# Altium project New_MB.PrjPcb
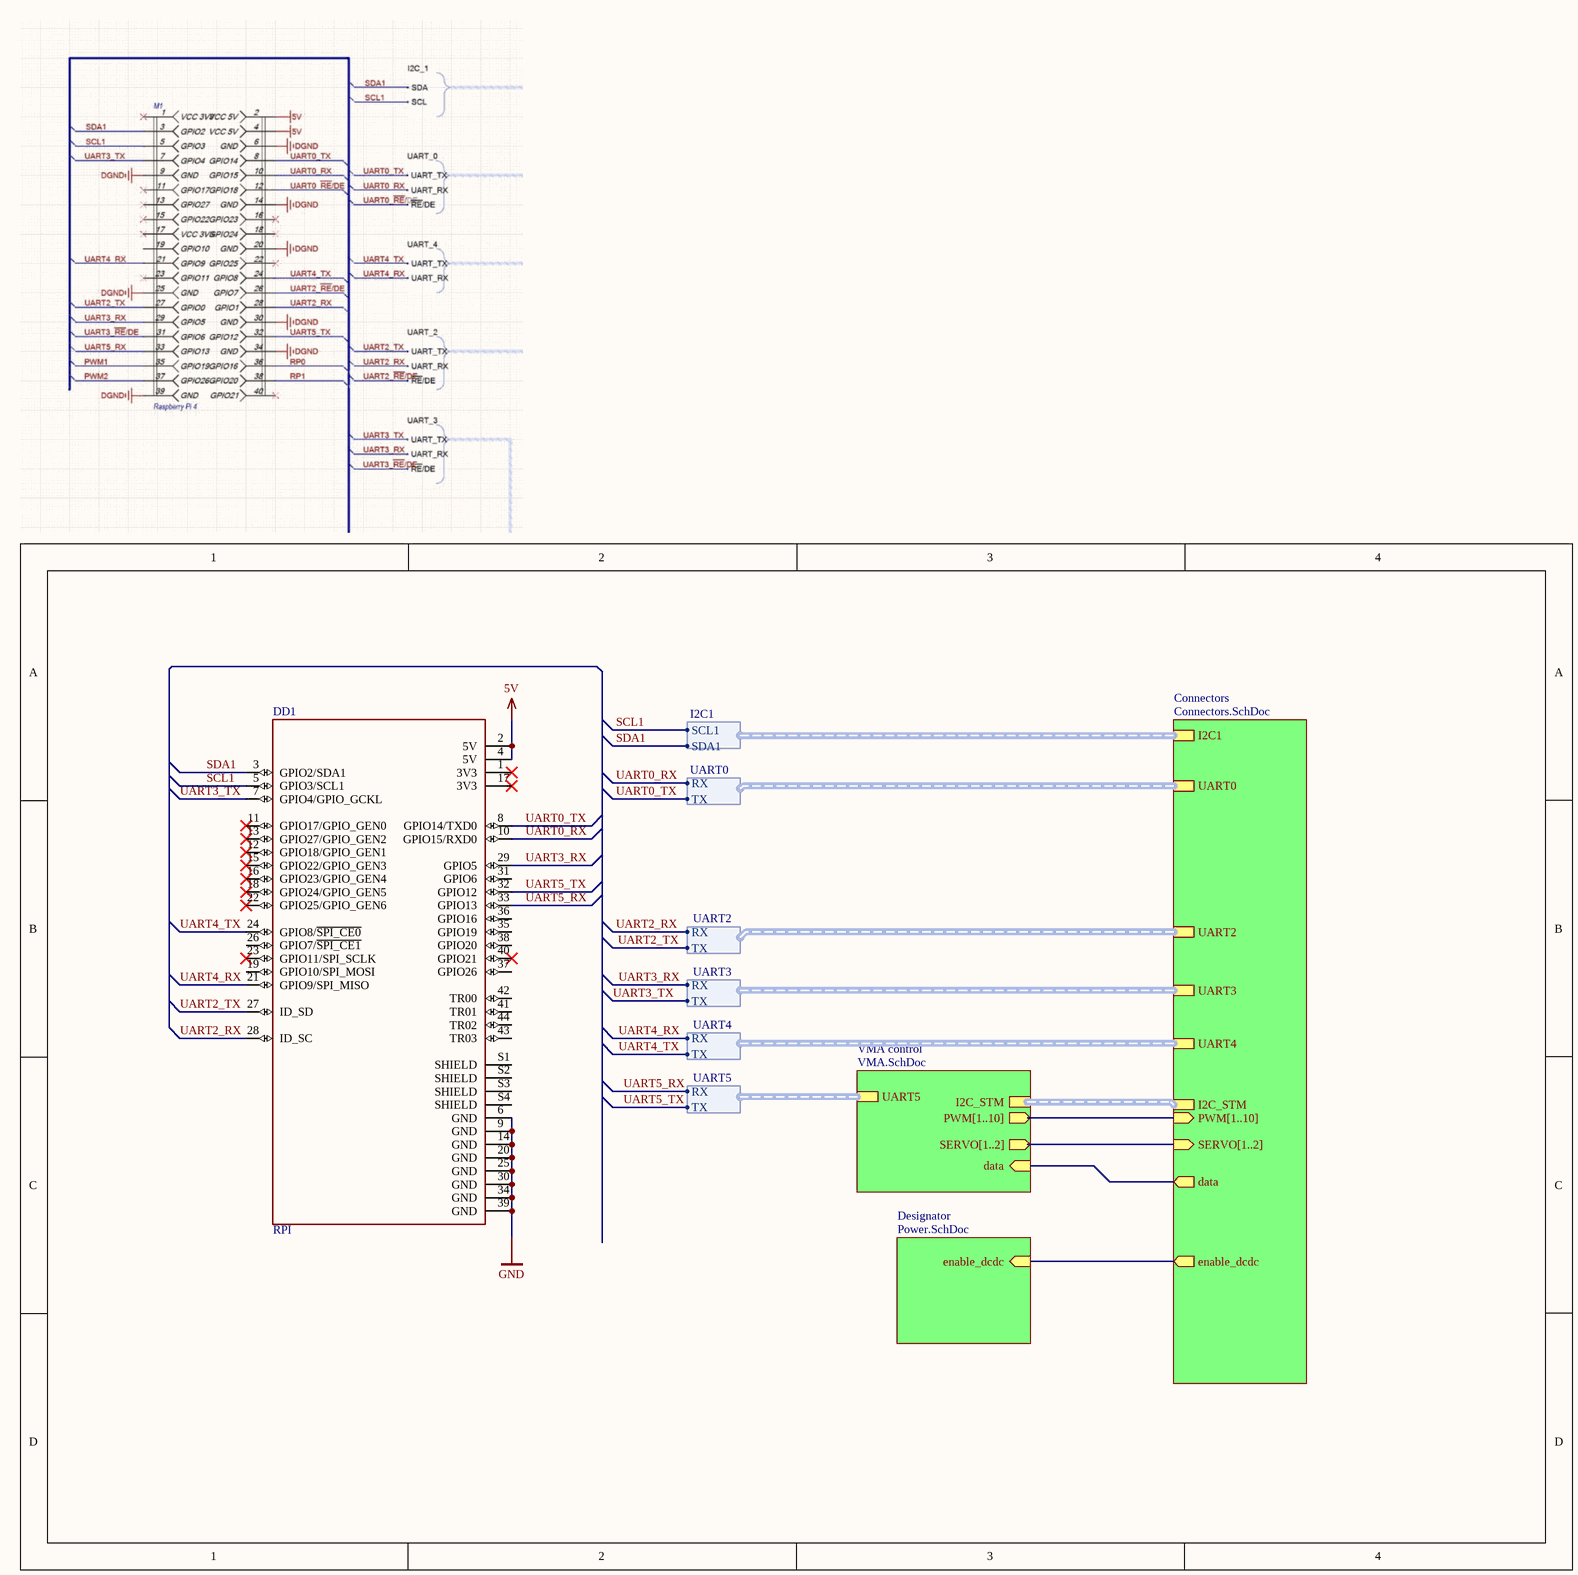
[diagram p0: Main.SchDoc]
4 sheets, 25 parts. Net scope: hierarchical (ports join the sheet entries above them; power ports are global).
Board file: Motherboard_Neowelt.PcbDoc
Sheets:
  Main.SchDoc
    VMA control = VMA.SchDoc
    Connectors = Connectors.SchDoc
    Designator = Power.SchDoc

## Sheet Main.SchDoc
size A4; SheetNumber: 1; SheetTotal: 4

### Parts
DD1  RPI  [RPI]

### Sub-sheets
Connectors = Connectors.SchDoc: PWM[1..10] (in), SERVO[1..2] (in), I2C1 (harness I2C1), UART3 (harness UART3), UART0 (harness UART0), UART2 (harness UART2), I2C_STM (harness I2C_STM), UART4 (harness UART4), enable_dcdc (out), data (out)
Designator = Power.SchDoc: enable_dcdc (in)
VMA control = VMA.SchDoc: UART5 (harness UART5), I2C_STM (harness I2C_STM), PWM[1..10] (out), SERVO[1..2] (out), data (in)

### Harnesses
I2C1: SCL1, SDA1
UART0: RX, TX
UART2: RX, TX
UART3: RX, TX
UART4: RX, TX
UART5: RX, TX

### Nets
5V: DD1.2(5V) DD1.4(5V)
GND: DD1.6(GND) DD1.9(GND) DD1.14(GND) DD1.20(GND) DD1.25(GND) DD1.30(GND) DD1.34(GND) DD1.39(GND)
data: sheet VMA control/data, sheet Connectors/data
enable_dcdc: sheet Connectors/enable_dcdc, sheet Designator/enable_dcdc
SCL1: DD1.5(GPIO3/SCL1) ; sheet Connectors/I2C1.SCL1  [project net I2C1_SCL]
SDA1: DD1.3(GPIO2/SDA1) ; sheet Connectors/I2C1.SDA1  [project net I2C1_SDA]
UART0_RX: DD1.10(GPIO15/RXD0) ; sheet Connectors/UART0.RX
UART0_TX: DD1.8(GPIO14/TXD0) ; sheet Connectors/UART0.TX
UART2_RX: DD1.28(ID_SC) ; sheet Connectors/UART2.RX
UART2_TX: DD1.27(ID_SD) ; sheet Connectors/UART2.TX
UART3_RX: DD1.29(GPIO5) ; sheet Connectors/UART3.RX
UART3_TX: DD1.7(GPIO4/GPIO_GCKL) ; sheet Connectors/UART3.TX
UART4_RX: DD1.21(GPIO9/SPI_MISO) ; sheet Connectors/UART4.RX
UART4_TX: DD1.24(GPIO8/~{SPI_CE0}) ; sheet Connectors/UART4.TX
UART5_RX: DD1.33(GPIO13) ; sheet VMA control/UART5.RX  [project net STM_TX]
UART5_TX: DD1.32(GPIO12) ; sheet VMA control/UART5.TX  [project net STM_RX]

Not connected (* = marked no-connect by the designer): DD1 1(3V3)* 11(GPIO17/GPIO_GEN0)* 12(GPIO18/GPIO_GEN1)* 13(GPIO27/GPIO_GEN2)* 15(GPIO22/GPIO_GEN3)* 16(GPIO23/GPIO_GEN4)* 17(3V3)* 18(GPIO24/GPIO_GEN5)* 19(GPIO10/SPI_MOSI) 22(GPIO25/GPIO_GEN6)* 23(GPIO11/SPI_SCLK)* 26(GPIO7/~{SPI_CE1}) 31(GPIO6) 35(GPIO19) 36(GPIO16) 37(GPIO26) 38(GPIO20) 40(GPIO21)* 41(TR01) 42(TR00) 43(TR03) 44(TR02) S1(SHIELD) S2(SHIELD) S3(SHIELD) S4(SHIELD)

### Buses and harness runs
bus sheet Connectors/PWM[1..10] = sheet VMA control/PWM[1..10]
bus sheet Connectors/SERVO[1..2] = sheet VMA control/SERVO[1..2]
harness sheet Connectors/I2C_STM = sheet VMA control/I2C_STM

### Library data of the parts
DD1 = RPI: Part Number: RPI

## Sheet VMA.SchDoc
size A3; SheetNumber: 4; SheetTotal: 4
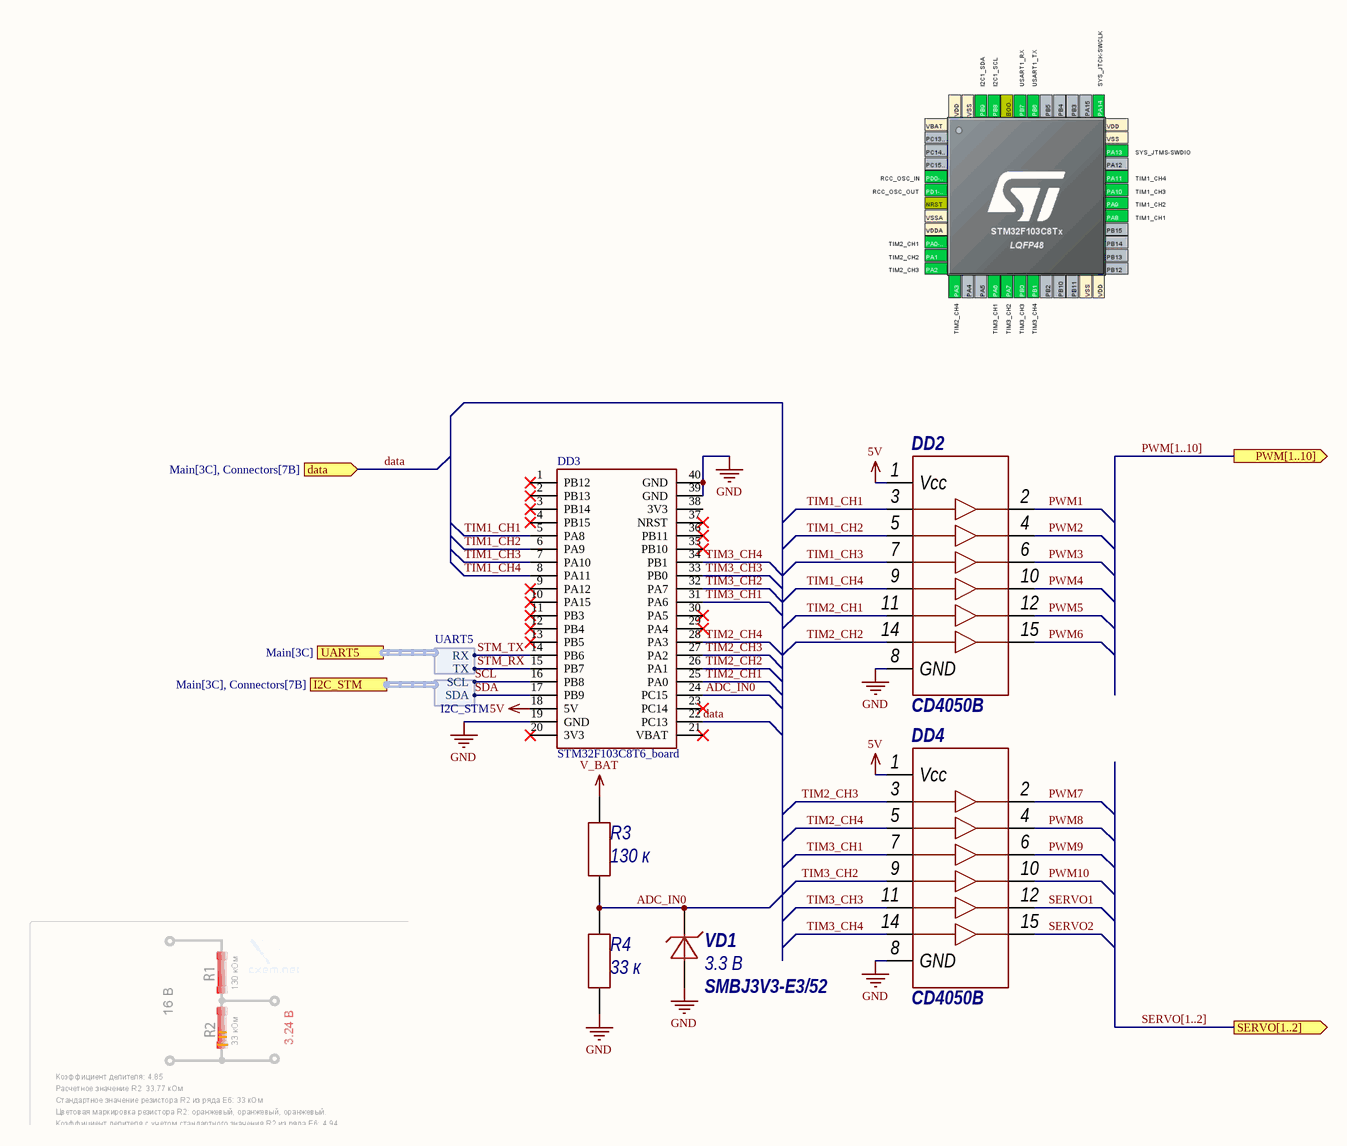
[diagram p1: VMA.SchDoc]

### Parts
DD2  CD4050B  [DIP16_in_socket]
DD3  STM32F103C8T6_board  [STM32F103C8T6_board]
DD4  CD4050B  [DIP16_in_socket]
R3  value 130 к  [0603R]  (hidden comment: Resistor)
R4  value 33 к  [0603R]  (hidden comment: Resistor)
VD1  SMBJ3V3-E3/52  value 3.3 В  [SMB]

### Ports
data (in, see Main[3C], Connectors[7B]), I2C_STM (harness I2C_STM, see Main[3C], Connectors[7B]), PWM[1..10] (out, see Main[3C], Connectors[7C]), SERVO[1..2] (out, see Main[3C], Connectors[7C]), UART5 (harness UART5, see Main[3C])

### Harnesses
UART5: TX, RX
I2C_STM: SCL, SDA

### Nets
5V: DD2.1(Vcc) DD3.18(5V) DD4.1(Vcc)
GND: DD2.8(GND) DD3.19(GND) DD3.39(GND) DD3.40(GND) DD4.8(GND) R4.1 VD1.1
V_BAT: R3.2
ADC_IN0: DD3.24(PC15) R3.1 R4.2 VD1.2
data: DD3.22(PC13) ; port data
PWM1: DD2.2(Y1)
PWM2: DD2.4(Y2)
PWM3: DD2.6(Y3)
PWM4: DD2.10(Y10)
PWM5: DD2.12(Y5)
PWM6: DD2.15(Y6)
PWM7: DD4.2(Y1)
PWM8: DD4.4(Y2)
PWM9: DD4.6(Y3)
PWM10: DD4.10(Y10)
SCL: DD3.16(PB8) ; port I2C_STM.SCL  [project net I2C2_SCL]
SDA: DD3.17(PB9) ; port I2C_STM.SDA  [project net I2C2_SDA]
SERVO1: DD4.12(Y5)
SERVO2: DD4.15(Y6)
STM_RX: DD3.15(PB7) ; port UART5.TX
STM_TX: DD3.14(PB6) ; port UART5.RX
TIM1_CH1: DD2.3(A1) DD3.5(PA8)
TIM1_CH2: DD2.5(A2) DD3.6(PA9)
TIM1_CH3: DD2.7(A3) DD3.7(PA10)
TIM1_CH4: DD2.9(A4) DD3.8(PA11)
TIM2_CH1: DD2.11(A5) DD3.25(PA0)
TIM2_CH2: DD2.14(A6) DD3.26(PA1)
TIM2_CH3: DD3.27(PA2) DD4.3(A1)
TIM2_CH4: DD3.28(PA3) DD4.5(A2)
TIM3_CH1: DD3.31(PA6) DD4.7(A3)
TIM3_CH2: DD3.32(PA7) DD4.9(A4)
TIM3_CH3: DD3.33(PB0) DD4.11(A5)
TIM3_CH4: DD3.34(PB1) DD4.14(A6)

Not connected (* = marked no-connect by the designer): DD3 1(PB12)* 2(PB13)* 3(PB14)* 4(PB15)* 9(PA12)* 10(PA15)* 11(PB3)* 12(PB4)* 13(PB5)* 20(3V3)* 21(VBAT)* 23(PC14)* 29(PA4)* 30(PA5)* 35(PB10)* 36(PB11)* 37(NRST)* 38(3V3)

### Buses and harness runs
bus PWM[1..10] = port PWM[1..10]
bus SERVO[1..2] = port SERVO[1..2]

### Library data of the parts
DD2 DD4 = CD4050B: Шесть буферных элементов; Part Number: CD4050B
DD3 = STM32F103C8T6_board: blue pill; Part Number: STM32F103C8T6_board
R3 = Resistor_130k_1_0603: Резистор номиналом 130 кОм и точностью 1%; Power: *; Part Number: Resistor_130k_1_0603; Tolerance: 1%
R4 = Resistor_33k_1_0603: Резистор номиналом 33 кОм и точностью 1%; Power: *; Part Number: Resistor_33k_1_0603; Tolerance: 1%
VD1 = SMBJ15A: Защитный диод на 15 В, рассеиваемая мощность 600 Вт; Voltage nominal (V): 15; Power (W): 600; Part Number: SMBJ15A; ComponentLink1Description: Где купить; ComponentLink1URL: https://www.chipdip.ru/product/smbj3v3-e3-52-2

## Sheet Connectors.SchDoc
size A3; SheetNumber: 3; SheetTotal: 4
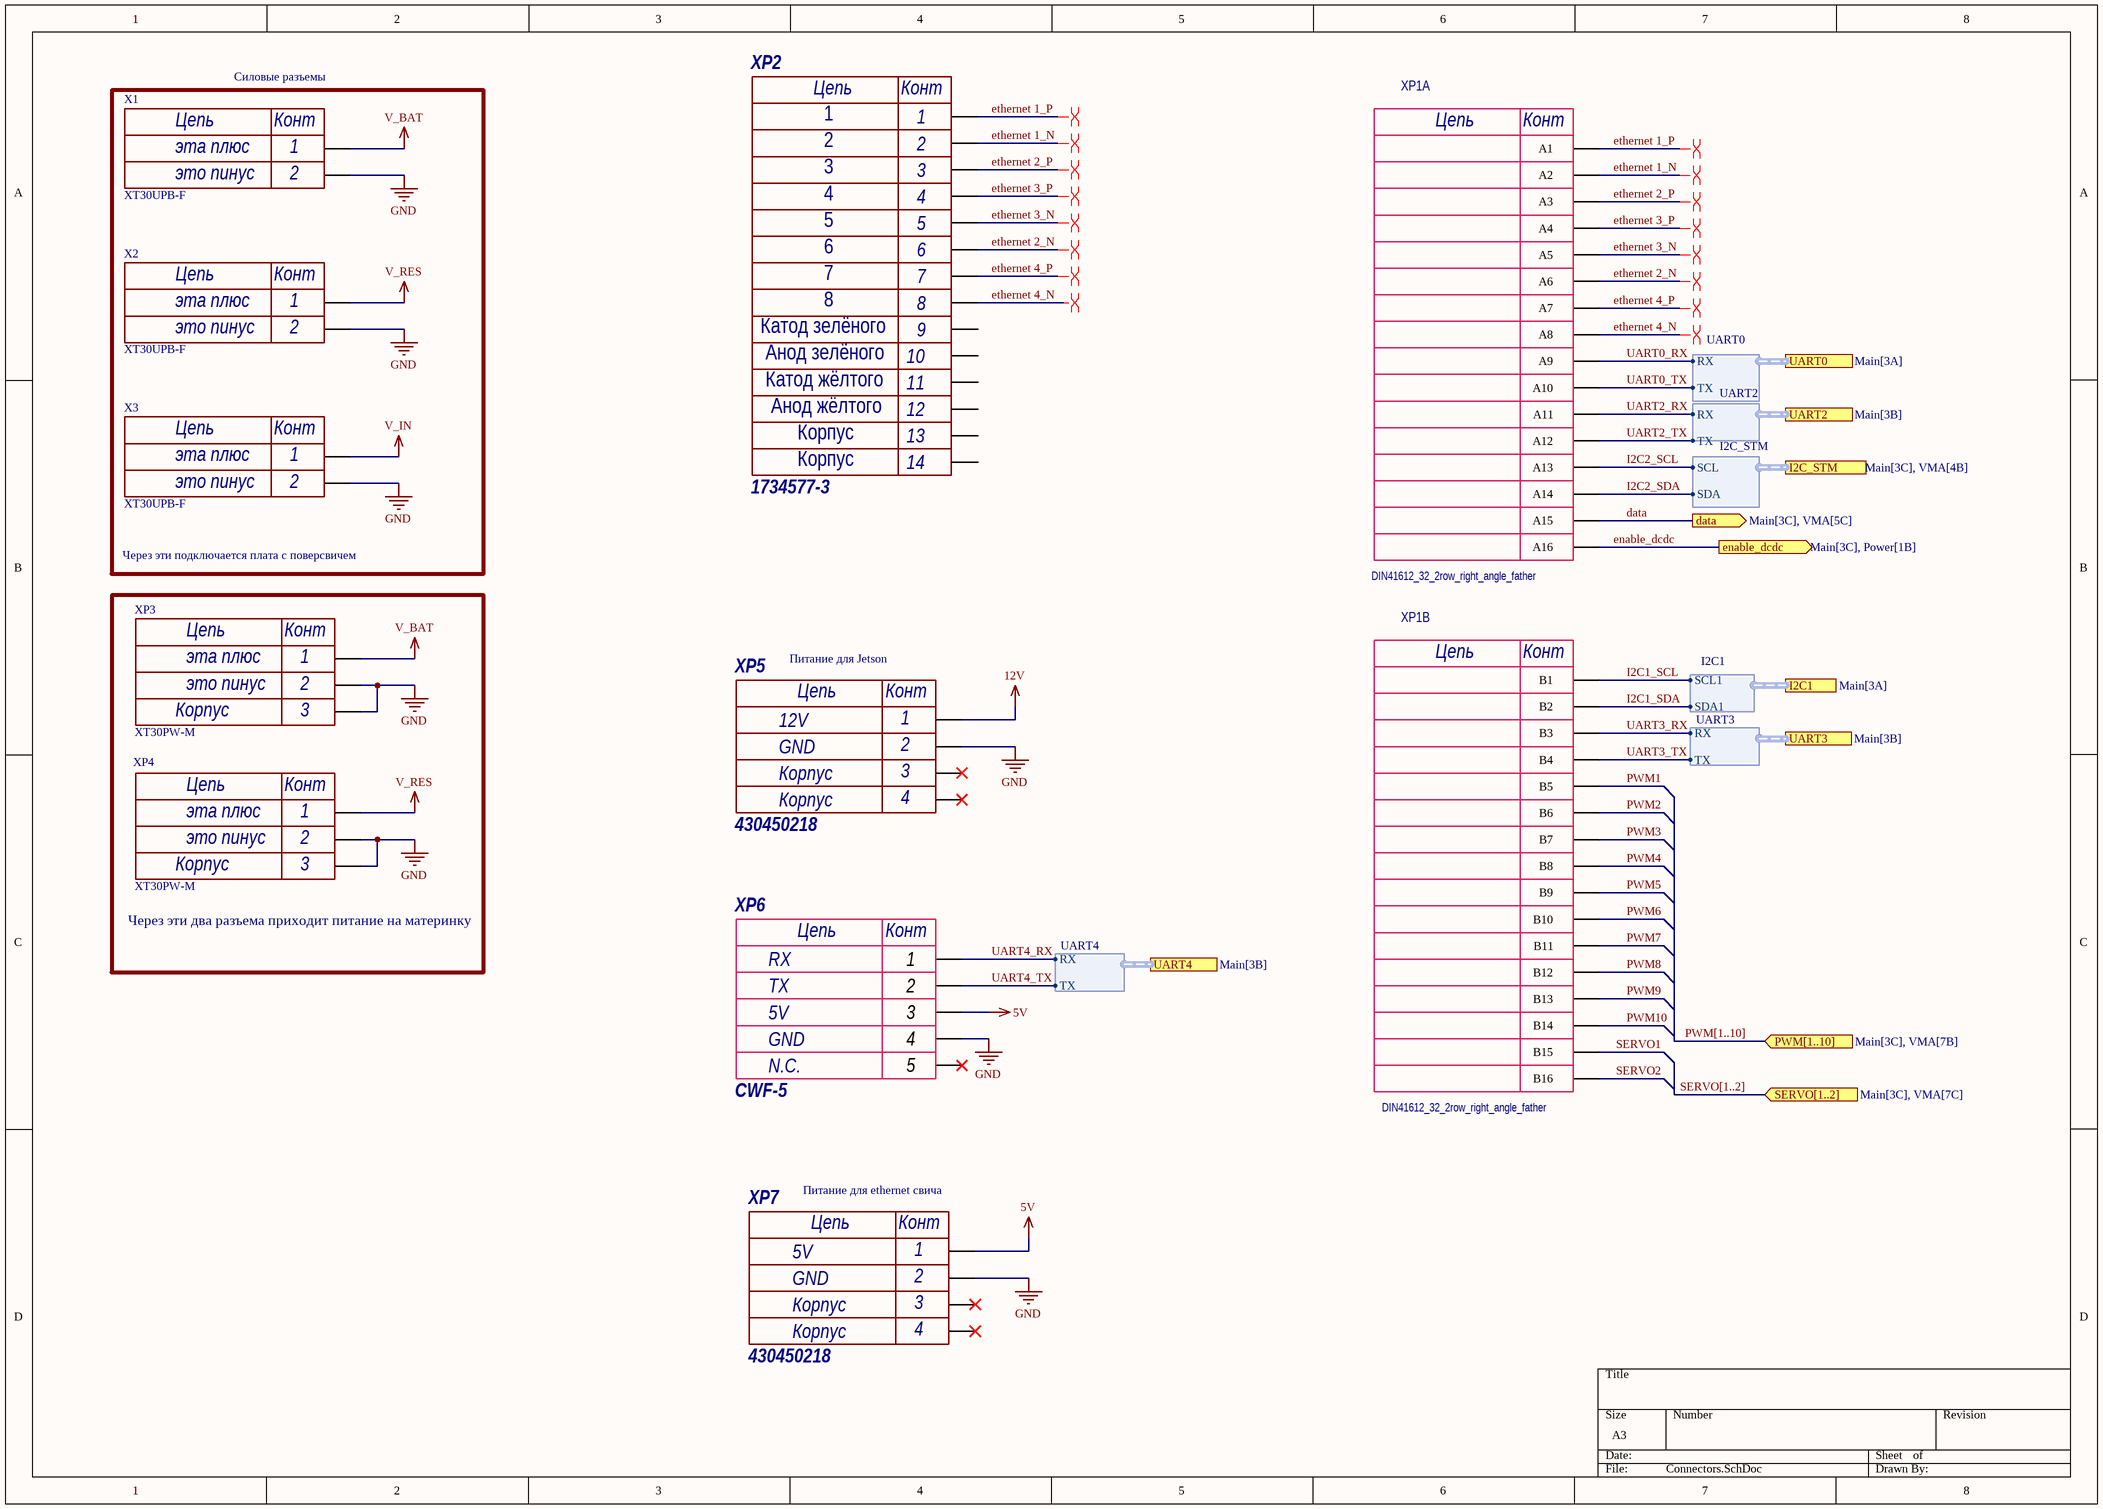
[diagram p2: Connectors.SchDoc]

### Parts
X1  XT30UPB-F  Value2: это пинус  Value1: эта плюс  [XT30UPB-F]
X2  XT30UPB-F  Value2: это пинус  Value1: эта плюс  [XT30UPB-F]
X3  XT30UPB-F  Value2: это пинус  Value1: эта плюс  [XT30UPB-F]
XP1  DIN41612_32_2row_right_angle_father  [DIN41612_32_2row_right_angle_father]  (parts A,B of 2)
XP2  1734577-3  [1-1734577-3-rj45-8p8c]
XP3  XT30PW-M  Value3: Корпус  Value2: это пинус  Value1: эта плюс  [XT30PW-M]
XP4  XT30PW-M  Value3: Корпус  Value2: это пинус  Value1: эта плюс  [XT30PW-M]
XP5  430450218  Value3: Корпус  Value2: GND  Value1: 12V  Parameter 1: Питание для Jetson  [Molex_430450218]
XP6  CWF-5  Value1: RX  Value2: TX  Value3: 5V  Value4: GND  Value5: N.C.  [CWF-5]
XP7  430450218  Value3: Корпус  Value2: GND  Value1: 5V  Parameter 1: Питание для ethernet свича  [Molex_430450218]

### Blocks framed on the sheet
Через эти два разъема приходит питание на материнку: XP3 XP4

### Ports
data (out, see Main[3C], VMA[5C]), enable_dcdc (out, see Main[3C], Power[1B]), I2C1 (harness I2C1, see Main[3A]), I2C_STM (harness I2C_STM, see Main[3C], VMA[4B]), PWM[1..10] (in, see Main[3C], VMA[7B]), SERVO[1..2] (in, see Main[3C], VMA[7C]), UART0 (harness UART0, see Main[3A]), UART2 (harness UART2, see Main[3B]), UART3 (harness UART3, see Main[3B]), UART4 (harness UART4, see Main[3B])

### Harnesses
I2C1: SDA1, SCL1
UART3: RX, TX
UART0: RX, TX
UART2: RX, TX
I2C_STM: SDA, SCL
UART4: RX, TX

### Nets
5V: XP6.3 XP7.1
12V: XP5.1
GND: X1.N X2.N X3.N XP3.0 XP3.N XP4.0 XP4.N XP5.2 XP6.4 XP7.2
V_BAT: X1.P XP3.P
V_IN: X3.P
V_RES: X2.P XP4.P
data: XP1.A15 ; port data
enable_dcdc: XP1.A16 ; port enable_dcdc
ethernet 1_N: XP1.A2 XP2.2
ethernet 1_P: XP1.A1 XP2.1
ethernet 2_N: XP1.A6 XP2.6
ethernet 2_P: XP1.A3 XP2.3
ethernet 3_N: XP1.A5 XP2.5
ethernet 3_P: XP1.A4 XP2.4
ethernet 4_N: XP1.A8 XP2.8
ethernet 4_P: XP1.A7 XP2.7
I2C1_SCL: XP1.B1 ; port I2C1.SCL1
I2C1_SDA: XP1.B2 ; port I2C1.SDA1
I2C2_SCL: XP1.A13 ; port I2C_STM.SCL
I2C2_SDA: XP1.A14 ; port I2C_STM.SDA
PWM1: XP1.B5
PWM2: XP1.B6
PWM3: XP1.B7
PWM4: XP1.B8
PWM5: XP1.B9
PWM6: XP1.B10
PWM7: XP1.B11
PWM8: XP1.B12
PWM9: XP1.B13
PWM10: XP1.B14
SERVO1: XP1.B15
SERVO2: XP1.B16
UART0_RX: XP1.A9 ; port UART0.RX
UART0_TX: XP1.A10 ; port UART0.TX
UART2_RX: XP1.A11 ; port UART2.RX
UART2_TX: XP1.A12 ; port UART2.TX
UART3_RX: XP1.B3 ; port UART3.RX
UART3_TX: XP1.B4 ; port UART3.TX
UART4_RX: XP6.1 ; port UART4.RX
UART4_TX: XP6.2 ; port UART4.TX

Not connected (* = marked no-connect by the designer): XP2 9 10 11 12 MH1 MH2; XP5 0*; XP6 5*; XP7 0*

### Buses and harness runs
bus PWM[1..10] = port PWM[1..10]
bus SERVO[1..2] = port SERVO[1..2]

### Layout directives
differential pair: ethernet 1_N, ethernet 1_P, ethernet 2_N, ethernet 2_P, ethernet 3_N, ethernet 3_P, ethernet 4_N, ethernet 4_P

### Notes on the sheet
- Силовые разъемы
- Через эти подключается плата с поверсвичем
- (in symbol 1-1734577-3-rj45-8p8c) Цепь; Конт; Катод зелёного; Анод зелёного; Катод жёлтого; Анод жёлтого; Корпус; 13; 14
- (in symbol CWF-5) Цепь; Конт
- (in symbol DIN41612_32_2row_right_angle_father, part A) Цепь; Конт
- (in symbol DIN41612_32_2row_right_angle_father, part B) Цепь; Конт
- (in symbol Molex_430450218) Цепь; Конт; 3; 4
- (in symbol XT30PW-M) Цепь; Конт; 1; 2; 3
- (in symbol XT30UPB-F) Цепь; Конт; 1; 2

### Library data of the parts
X1-X3 = XT30UPB-F: 30 А (15 продолжительно), прямая мать; Part Number: XT30UPB-F
XP1 = DIN41612_32_2row_right_angle_father: DIN41612R (DS1118-32M0R23), Разъем (вилка) тип B 32pin (2х16), шаг 2.54мм двухрядный угловой (ряд АВ); System: Connector; Part Number: DIN41612_32_2row_right_angle_father
XP2 = 1-1734577-3-rj45-8p8c: Модульный разъем, Cat3, RJ45, Гнездо, 8 контакт(-ов), 8 вывод(-ов), 1 порт(-ов); Part Number: 1-1734577-3-rj45-8p8c
XP3 XP4 = XT30PW-M: 30 А (15 продолжительно), 2 контакта разъем угловой отец; System: Connector; Part Number: XT30PW-M
XP5 XP7 = Molex_430450218: Разъем типа провод-плата, 3 мм, 2 контакт(-ов), Штыревой Разъем, Серия Micro-Fit для поверхностного монтажа; Value4: Корпус; Part Number: Molex_430450218
XP6 = CWF-5: 5-пиновый разъем с ключом; Part Number: CWF-5

## Sheet Power.SchDoc
size A4; SheetNumber: 2; SheetTotal: 4
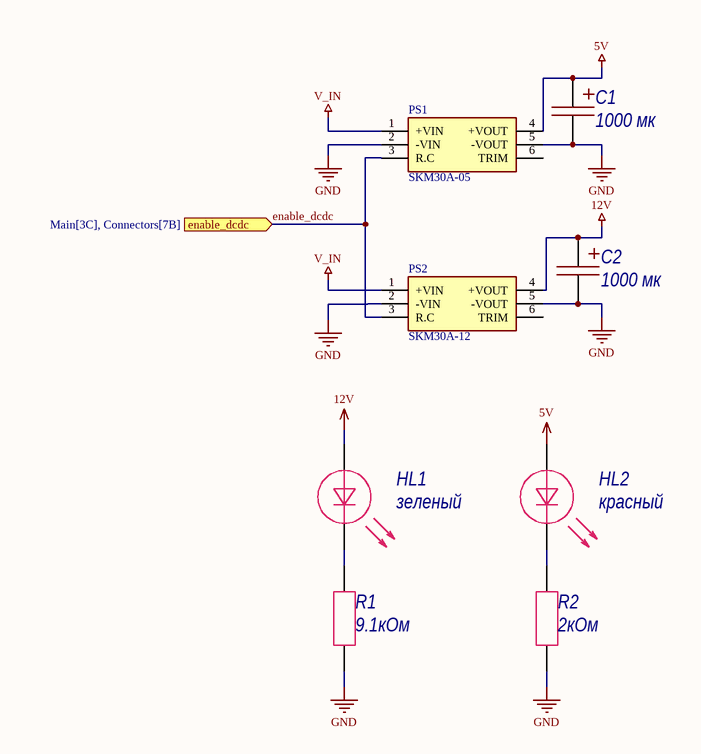
[diagram p3: Power.SchDoc]

### Parts
C1  value 1000 мк  [TC_A]  (hidden comment: Capacitor)
C2  value 1000 мк  [TC_A]  (hidden comment: Capacitor)
HL1  Color: зеленый  [0805D]
HL2  Color: красный  [0805D]
PS1  SKM30A-05  [SKM30A05]
PS2  SKM30A-12  [SKM30B12]
R1  value 9.1кОм  [0805R]  (hidden comment: Resistor)
R2  value 2кОм  [0805R]  (hidden comment: Resistor)

### Ports
enable_dcdc (in, see Main[3C], Connectors[7B])

### Nets
5V: C1.1 HL2.1 PS1.4(+VOUT)
12V: C2.1 HL1.1 PS2.4(+VOUT)
GND: C1.2 C2.2 PS1.2(-VIN) PS1.5(-VOUT) PS2.2(-VIN) PS2.5(-VOUT) R1.1 R2.1
V_IN: PS1.1(+VIN) PS2.1(+VIN)
enable_dcdc: PS1.3(R.C) PS2.3(R.C) ; port enable_dcdc
NetHL1_2: HL1.2 R1.2
NetHL2_2: HL2.2 R2.2

Not connected (* = marked no-connect by the designer): PS1 6(TRIM); PS2 6(TRIM)

### Library data of the parts
C1 C2 = Capacitor_1000u_10_50V_TC_A: Танталовый конденсатор; Tolerance: 0,1; Voltage (V): 50; Type: Tantalum; Capacity (uF): 1000; Part Number: Capacitor_1000u_10_50V_TC_A
HL1 HL2 = LED: Manufacturer: -; Rate: -; Datasheet: -; Shop: -; Notice: -; Case: -
PS1 = SKM30A-05: Power Supply; Manufacturer_Name: Mean Well; Datasheet Link: https://www.meanwell.com/webapp/product/search.aspx?prod=SKM30; Height: 11.2mm; Manufacturer_Part_Number: SKM30A-05; Mouser Part Number: 709-SKM30A-05; Mouser Price/Stock: https://www.mouser.co.uk/ProductDetail/MEAN-WELL/SKM30A-05?qs=WtedIhRlNpsvgfTGPi4UAw%3D%3D
PS2 = SKM30A-12: Power Supply; Manufacturer_Name: Mean Well; Datasheet Link: https://www.meanwell.com/webapp/product/search.aspx?prod=SKM30; Height: 11.2mm; Manufacturer_Part_Number: SKM30A-12; Mouser Part Number: 709-SKM30A-12; Mouser Price/Stock: https://www.mouser.co.uk/ProductDetail/MEAN-WELL/SKM30A-12?qs=WtedIhRlNpuG9wDURm5lSA%3D%3D; Arrow Part Number: SKM30A-12; Arrow Price/Stock: https://www.arrow.com/en/products/skm30a-12/mean-well-enterprises

## Nets that join several sheets
5V: Main (DD1.2 DD1.4), VMA (DD2.1 DD3.18 DD4.1), Connectors (XP6.3 XP7.1), Power (C1.1 HL2.1 PS1.4)
12V: Connectors (XP5.1), Power (C2.1 HL1.1 PS2.4)
GND: Main (8 pins), VMA (7 pins), Connectors (10 pins), Power (8 pins)
V_BAT: VMA (R3.2), Connectors (X1.P XP3.P)
V_IN: Connectors (X3.P), Power (PS1.1 PS2.1)
data: VMA (DD3.22), Connectors (XP1.A15)
enable_dcdc: Connectors (XP1.A16), Power (PS1.3 PS2.3)
I2C1_SCL: Main (DD1.5), Connectors (XP1.B1)
I2C1_SDA: Main (DD1.3), Connectors (XP1.B2)
I2C2_SCL: VMA (DD3.16), Connectors (XP1.A13)
I2C2_SDA: VMA (DD3.17), Connectors (XP1.A14)
PWM1: VMA (DD2.2), Connectors (XP1.B5)
PWM2: VMA (DD2.4), Connectors (XP1.B6)
PWM3: VMA (DD2.6), Connectors (XP1.B7)
PWM4: VMA (DD2.10), Connectors (XP1.B8)
PWM5: VMA (DD2.12), Connectors (XP1.B9)
PWM6: VMA (DD2.15), Connectors (XP1.B10)
PWM7: VMA (DD4.2), Connectors (XP1.B11)
PWM8: VMA (DD4.4), Connectors (XP1.B12)
PWM9: VMA (DD4.6), Connectors (XP1.B13)
PWM10: VMA (DD4.10), Connectors (XP1.B14)
SERVO1: VMA (DD4.12), Connectors (XP1.B15)
SERVO2: VMA (DD4.15), Connectors (XP1.B16)
STM_RX: Main (DD1.32), VMA (DD3.15)
STM_TX: Main (DD1.33), VMA (DD3.14)
UART0_RX: Main (DD1.10), Connectors (XP1.A9)
UART0_TX: Main (DD1.8), Connectors (XP1.A10)
UART2_RX: Main (DD1.28), Connectors (XP1.A11)
UART2_TX: Main (DD1.27), Connectors (XP1.A12)
UART3_RX: Main (DD1.29), Connectors (XP1.B3)
UART3_TX: Main (DD1.7), Connectors (XP1.B4)
UART4_RX: Main (DD1.21), Connectors (XP6.1)
UART4_TX: Main (DD1.24), Connectors (XP6.2)